# Altium schematic sheet POWER.SchDoc
size A3; Organization: Electronic Research & Design; Address1: 11 Granofier; Address2: Zwartkop; Address3: Centurion; Address4: South Africa
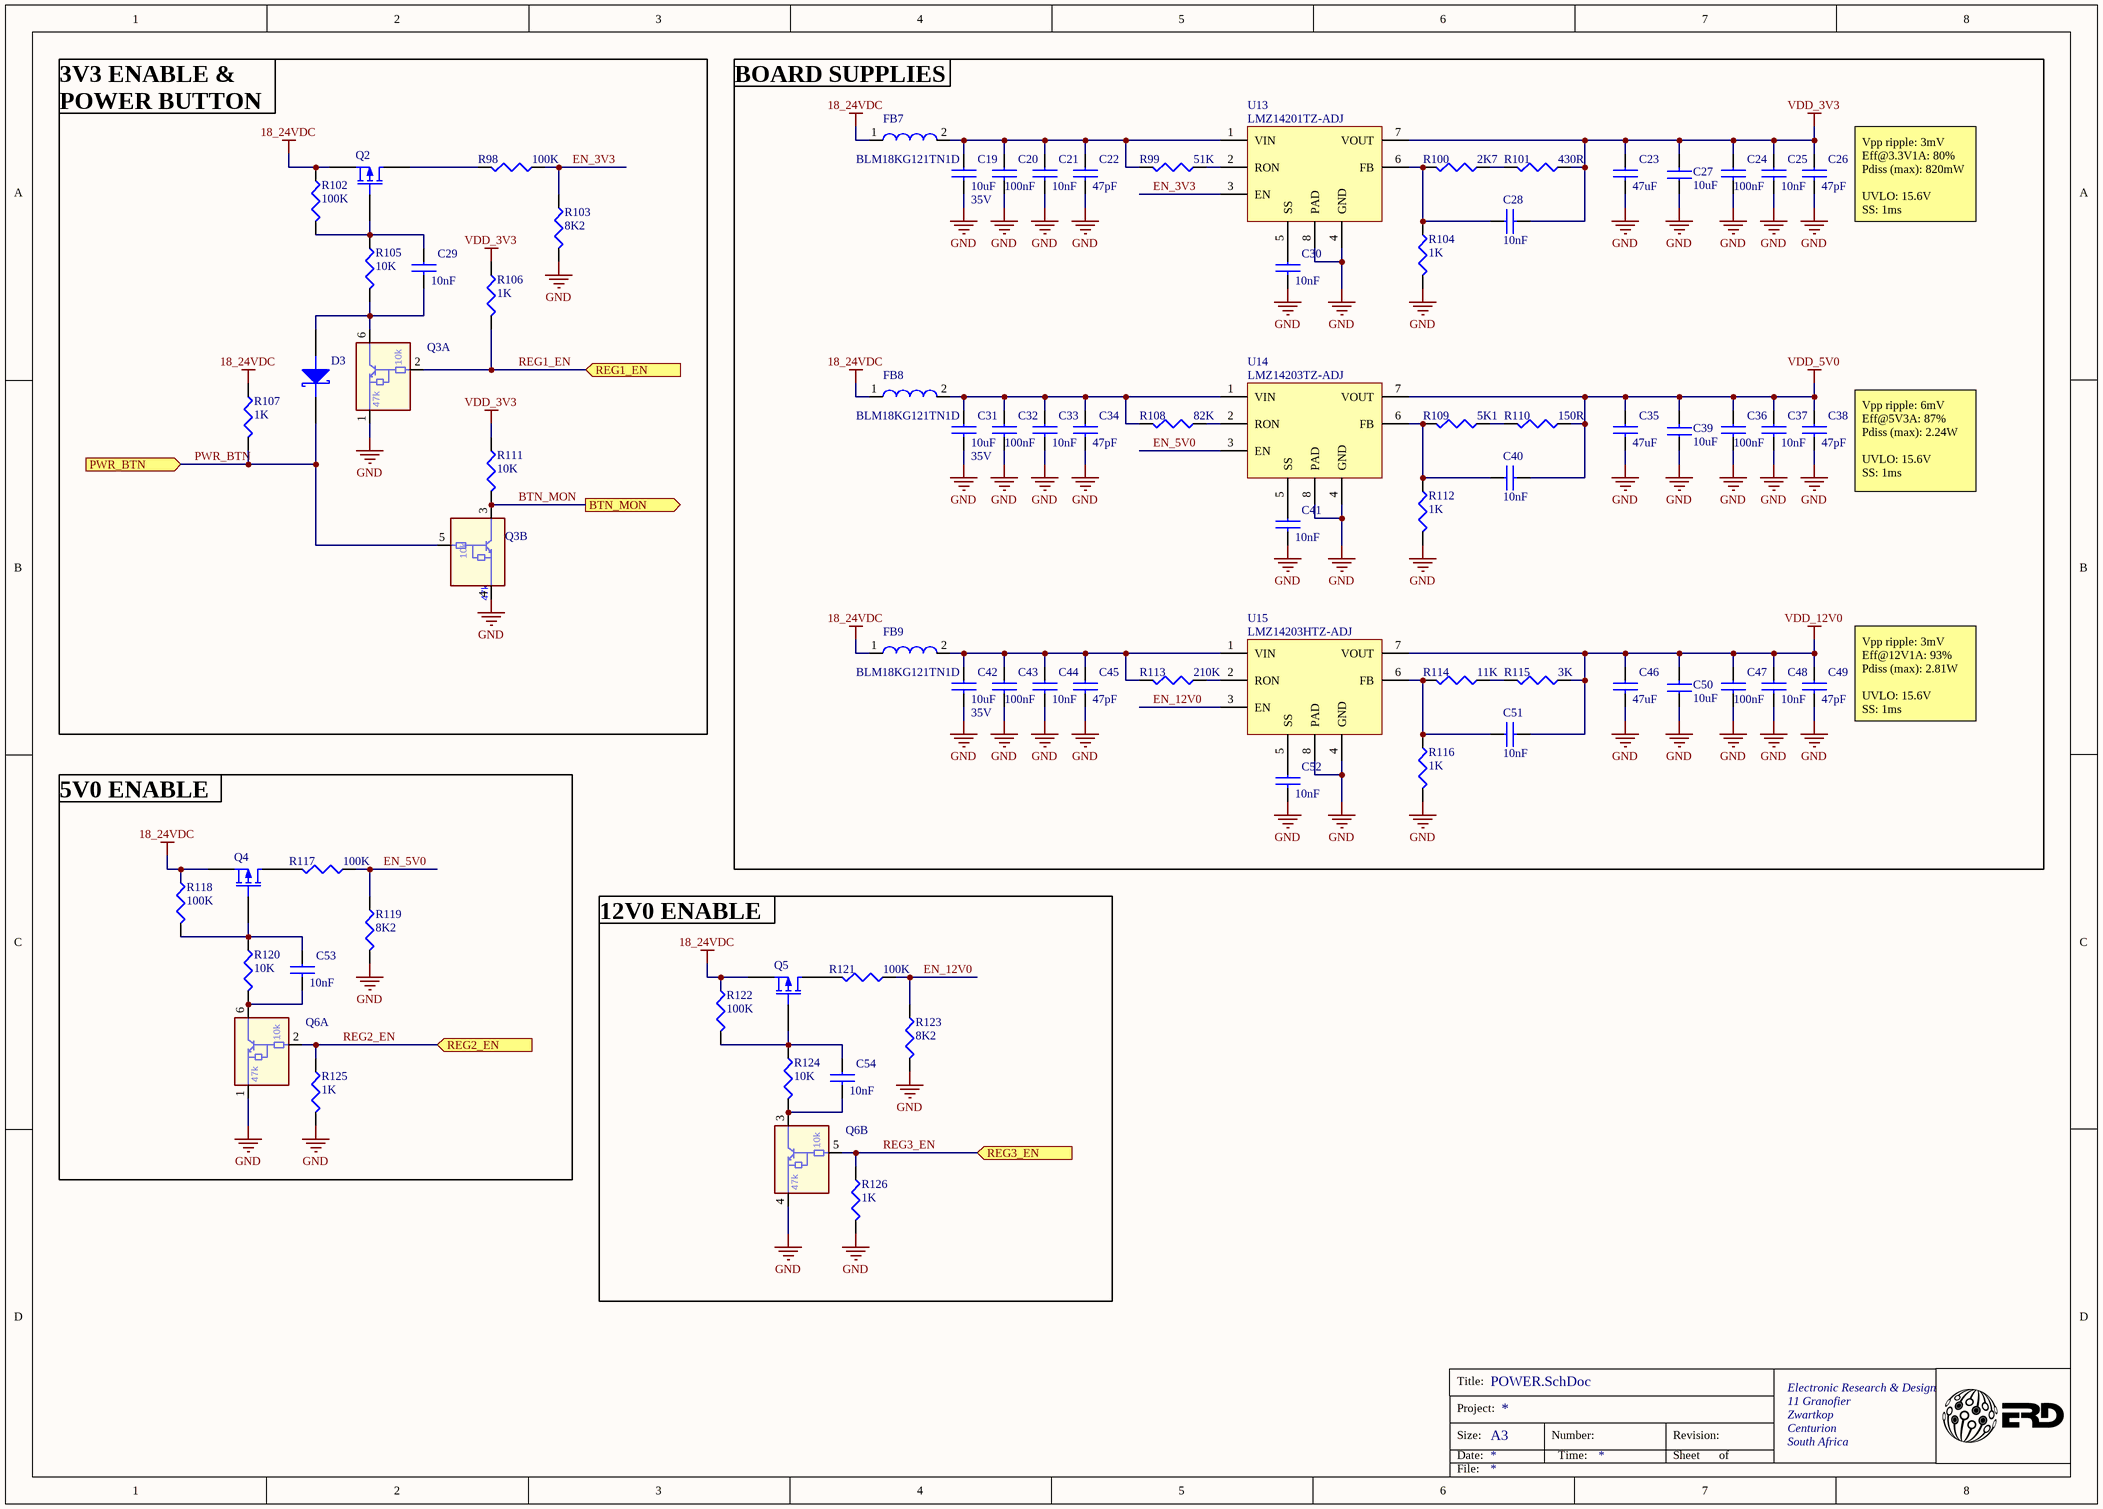
[diagram p0: POWER.SchDoc]

## Parts
C19  10uF  Voltage Rating: 35V  [CC0805]
C20  100nF  [CC0402]
C21  10nF  [CC0402]
C22  47pF  [CC0402]
C23  47uF  [RC1206]
C24  100nF  [CC0402]
C25  10nF  [CC0402]
C26  47pF  [CC0402]
C27  10uF  [CC0603]
C28  10nF  [CC0402]
C29  10nF  [CC0402]
C30  10nF  [CC0402]
C31  10uF  Voltage Rating: 35V  [CC0805]
C32  100nF  [CC0402]
C33  10nF  [CC0402]
C34  47pF  [CC0402]
C35  47uF  [RC1206]
C36  100nF  [CC0402]
C37  10nF  [CC0402]
C38  47pF  [CC0402]
C39  10uF  [CC0603]
C40  10nF  [CC0402]
C41  10nF  [CC0402]
C42  10uF  Voltage Rating: 35V  [CC0805]
C43  100nF  [CC0402]
C44  10nF  [CC0402]
C45  47pF  [CC0402]
C46  47uF  [RC1206]
C47  100nF  [CC0402]
C48  10nF  [CC0402]
C49  47pF  [CC0402]
C50  10uF  [CC0603]
C51  10nF  [CC0402]
C52  10nF  [CC0402]
C53  10nF  [CC0402]
C54  10nF  [CC0402]
D3  PMEG10020ELRX  [SOD123W]  (value not drawn)
FB7  BLM18KG121TN1D  [LC0603]
FB8  BLM18KG121TN1D  [LC0603]
FB9  BLM18KG121TN1D  [LC0603]
Q2  MOSFET-P  [E3]  (value not drawn)
Q3  DDC114YU-7-F  [SMini6-F3-B]  (value not drawn)  (parts A,B of 2)
Q4  MOSFET-P  [E3]  (value not drawn)
Q5  MOSFET-P  [E3]  (value not drawn)
Q6  DDC114YU-7-F  [SMini6-F3-B]  (value not drawn)  (parts A,B of 2)
R98  100K  [RC0402]
R99  51K  [RC0402]
R100  2K7  [RC0402]
R101  430R  [RC0402]
R102  100K  [RC0402]
R103  8K2  [RC0402]
R104  1K  [RC0402]
R105  10K  [RC0402]
R106  1K  [RC0402]
R107  1K  [RC0402]
R108  82K  [RC0402]
R109  5K1  [RC0402]
R110  150R  [RC0402]
R111  10K  [RC0402]
R112  1K  [RC0402]
R113  210K  [RC0402]
R114  11K  [RC0402]
R115  3K  [RC0402]
R116  1K  [RC0402]
R117  100K  [RC0402]
R118  100K  [RC0402]
R119  8K2  [RC0402]
R120  10K  [RC0402]
R121  100K  [RC0402]
R122  100K  [RC0402]
R123  8K2  [RC0402]
R124  10K  [RC0402]
R125  1K  [RC0402]
R126  1K  [RC0402]
U13  LMZ14201TZ-ADJ  [TZA07A]
U14  LMZ14203TZ-ADJ  [TZA07A]
U15  LMZ14203HTZ-ADJ  [TZA07A]

## Ports
BTN_MON (out), PWR_BTN (in), REG1_EN (in), REG2_EN (in), REG3_EN (in)

## Nets
18_24VDC: FB7.1 FB8.1 FB9.1 Q2.3(S) Q4.3(S) Q5.3(S) R102.1 R107.1 R118.1 R122.1
GND: C19.2 C20.2 C21.2 C22.2 C23.2 C24.2 C25.2 C26.2 C27.1 C30.2 C31.2 C32.2 C33.2 C34.2 C35.2 C36.2 C37.2 C38.2 C39.1 C41.2 C42.2 C43.2 C44.2 C45.2 C46.2 C47.2 C48.2 C49.2 C50.1 C52.2 Q3.1 Q3.4 Q6.1 Q6.4 R103.2 R104.2 R112.2 R116.2 R119.2 R123.2 R125.2 R126.2 U13.4(GND) U13.8(PAD) U14.4(GND) U14.8(PAD) U15.4(GND) U15.8(PAD)
VDD_3V3: C23.1 C24.1 C25.1 C26.1 C27.2 C28.2 R101.1 R106.1 R111.1 U13.7(VOUT)
VDD_5V0: C35.1 C36.1 C37.1 C38.1 C39.2 C40.2 R110.1 U14.7(VOUT)
VDD_12V0: C46.1 C47.1 C48.1 C49.1 C50.2 C51.2 R115.1 U15.7(VOUT)
BTN_MON: Q3.3 R111.2 ; port BTN_MON
EN_3V3: R98.1 R103.1 U13.3(EN)
EN_5V0: R117.1 R119.1 U14.3(EN)
EN_12V0: R121.1 R123.1 U15.3(EN)
PWR_BTN: D3.1 Q3.5 R107.2 ; port PWR_BTN
REG1_EN: Q3.2 R106.2 ; port REG1_EN
REG2_EN: Q6.2 R125.1 ; port REG2_EN
REG3_EN: Q6.5 R126.1 ; port REG3_EN
NetC19_1: C19.1 C20.1 C21.1 C22.1 FB7.2 R99.2 U13.1(VIN)
NetC28_1: C28.1 R100.2 R104.1 U13.6(FB)
NetC29_1: C29.1 Q2.2(G) R102.2 R105.1
NetC29_2: C29.2 D3.2 Q3.6 R105.2
NetC30_1: C30.1 U13.5(SS)
NetC31_1: C31.1 C32.1 C33.1 C34.1 FB8.2 R108.2 U14.1(VIN)
NetC40_1: C40.1 R109.2 R112.1 U14.6(FB)
NetC41_1: C41.1 U14.5(SS)
NetC42_1: C42.1 C43.1 C44.1 C45.1 FB9.2 R113.2 U15.1(VIN)
NetC51_1: C51.1 R114.2 R116.1 U15.6(FB)
NetC52_1: C52.1 U15.5(SS)
NetC53_1: C53.1 Q4.2(G) R118.2 R120.1
NetC53_2: C53.2 Q6.6 R120.2
NetC54_1: C54.1 Q5.2(G) R122.2 R124.1
NetC54_2: C54.2 Q6.3 R124.2
NetQ2_1: Q2.1(D) R98.2
NetQ4_1: Q4.1(D) R117.2
NetQ5_1: Q5.1(D) R121.2
NetR99_1: R99.1 U13.2(RON)
NetR100_1: R100.1 R101.2
NetR108_1: R108.1 U14.2(RON)
NetR109_1: R109.1 R110.2
NetR113_1: R113.1 U15.2(RON)
NetR114_1: R114.1 R115.2

## Notes on the sheet
- 3V3 ENABLE & POWER BUTTON
- BOARD SUPPLIES
- (near C26) Vpp ripple: 3mV
  Eff@3.3V1A: 80%
  Pdiss (max): 820mW
  UVLO: 15.6V
  SS: 1ms
- (near C38) Vpp ripple: 6mV
  Eff@5V3A: 87%
  Pdiss (max): 2.24W
  UVLO: 15.6V
  SS: 1ms
- (near C49) Vpp ripple: 3mV
  Eff@12V1A: 93%
  Pdiss (max): 2.81W
  UVLO: 15.6V
  SS: 1ms
- 5V0 ENABLE
- 12V0 ENABLE
- Title:
- Size:
- Date:
- Project:
- A3
- Number:
- Time:
- Revision:
- Sheet
- of
- File:
- (in symbol RN1907, part A) 10k; 47k
- (in symbol RN1907, part B) 10k; 47k

## Library data of the parts
C19 C31 C42 = CAP CER 0.1UF 10V 10% X5R 0402: CAP CER 10UF 35V 10% X5R 0805; Manufacturer: Murata; Part Number: GRM21BR6YA106KE43L; Package / Case: 0805
C20 C24 C32 C36 C43 C47 = CAP CER 0.1UF 10V 10% X5R 0402: CAP CER 0.1UF 50V 10% X7R 0402; Manufacturer: Murata; Part Number: GCM155R71H104KE02D; Package / Case: 0402 (1005 Metric); Supplier: AAD
C21 C25 C28-C30 C33 C37 C40 C41 C44 C48 C51-C54 = CAP CER 0.1UF 10V 10% X5R 0402: CAP CER 10NF 50V 10% X7R 0402; Manufacturer: Murata; Part Number: GRM155R71H103KA88J; Package / Case: 0402; Voltage Rating: 50V
C22 C26 C34 C38 C45 C49 = CAP CER 0.1UF 10V 10% X5R 0402: CAP CER 47PF 50V 5% C0G/NP0 0402; Manufacturer: Murata; Part Number: GCM1555C1H470JA16D; Package / Case: 0402; Voltage Rating: 50V
C23 C35 C46 = CAP CER 0.1UF 10V 10% X5R 0402: CAP CER 47UF 25V 20% X5R 1206; Manufacturer: Murata; Part Number: C3216X5R1E476M160AC; Package / Case: 1206; Voltage Rating: 25v
C27 C39 C50 = CAP CER 0.1UF 10V 10% X5R 0402: CAP CER 10UF 25V 20% X5R 0603; Manufacturer: Murata; PartNumber: GRM188R61E106MA73D; Package / Case: 0603; Supplier: AAD
D3 = DIODE SCHOTTKY: DIODE, SCHOTTKY, 100V, 2A, 3.7ns, SOD123W; PartNumber: PMEG10020ELRX
FB7-FB9 = FER_180_200_0: FERRITE 3A 30mOHM 0603 SMD; PartNumber: BLM18KG121TN1D
Q2 Q4 Q5 = MOSFET-P: P-Channel MOSFET; Published: 8-Jun-2000; LatestRevisionDate: 17-Jul-2002; LatestRevisionNote: Re-released for DXP Platform.; PackageVersion: 1995/1996; PackageReference: E3; Publisher: Altium Limited; PackageDescription: TO, Flat Index; 3 In-Line, Axial Leads; Body Dia. 4.6mm; Lead Dia. 0.5 mm (max)
Q3 Q6 = RN1907: TRANS PREBIASED DUAL NPN SOT363; Manufacturer: Diodes Inc; Manufacturer Part Number: DDC114YU-7-F; Package / Case: 6-TSSOP, SC-88, SOT-363; Supplier: AAD; Supplier Stock Code: N/A
R98 R117 R121 = RES_10K_1/16W_1%_0402: RES, 100K OHM, 1/16W, 1%, 0402; Manufacturer: Yageo; PartNumber: RC0402FR-07100KL; Package / Case: 0402 (1005 Metric); Supplier: AAD
R99 = RES_10K_1/16W_1%_0402: RES, 51K OHM, 1/16W, 1%, 0402; Manufacturer: Yageo; PartNumber: RC0402FR-0751KL; Package / Case: 0402 (1005 Metric); Supplier: AAD
R100 = RES_10K_1/16W_1%_0402: RES, 2K7 OHM, 1/16W, 1%, 0402; Manufacturer: Yageo; PartNumber: RC0402FR-072K7L; Package / Case: 0402 (1005 Metric); Supplier: AAD
R101 = RES_10K_1/16W_1%_0402: RES, 430 OHM, 1/16W, 1%, 0402; Manufacturer: Yageo; PartNumber: RC0402FR-07430RL; Package / Case: 0402 (1005 Metric); Supplier: AAD
R102 R118 R122 = RES_10K_1/16W_1%_0402: RES, 100K OHM, 1/16W, 1%, 0402; Manufacturer: Yageo; Part Number: RC0402FR-07100KL; Package / Case: 0402 (1005 Metric); Supplier: AAD
R103 R119 R123 = RES_10K_1/16W_1%_0402: RES, 8K2 OHM, 1/16W, 1%, 0402; Manufacturer: Yageo; PartNumber: RC0402FR-078K2L; Package / Case: 0402 (1005 Metric); Supplier: AAD
R104 R106 R107 R112 R116 R125 R126 = RES_10K_1/16W_1%_0402: RES, 1K OHM, 1/16W, 1%, 0402; Manufacturer: Yageo; PartNumber: RC0402FR-071KL; Package / Case: 0402 (1005 Metric); Supplier: AAD
R105 R111 R120 R124 = RES_10K_1/16W_1%_0402: RES, 10K OHM, 1/16W, 1%, 0402; Manufacturer: Yageo; Part Number: RC0402FR-0710KL; Package / Case: 0402 (1005 Metric); Supplier: AAD
R108 = RES_10K_1/16W_1%_0402: RES, 82K OHM, 1/16W, 1%, 0402; Manufacturer: Yageo; PartNumber: RC0402FR-0782KL; Package / Case: 0402 (1005 Metric); Supplier: AAD
R109 = RES_10K_1/16W_1%_0402: RES, 5K1 OHM, 1/16W, 1%, 0402; Manufacturer: Yageo; PartNumber: RC0402FR-075K1L; Package / Case: 0402 (1005 Metric); Supplier: AAD
R110 = RES_10K_1/16W_1%_0402: RES, 150 OHM, 1/16W, 1%, 0402; Manufacturer: Yageo; PartNumber: RC0402FR-07150RL; Package / Case: 0402 (1005 Metric); Supplier: AAD
R113 = RES_10K_1/16W_1%_0402: RES, 210K OHM, 1/16W, 1%, 0402; Manufacturer: Yageo; PartNumber: RC0402FR-07210KL; Package / Case: 0402 (1005 Metric); Supplier: AAD
R114 = RES_10K_1/16W_1%_0402: RES, 11K OHM, 1/16W, 1%, 0402; Manufacturer: Yageo; PartNumber: RC0402FR-0711KL; Package / Case: 0402 (1005 Metric); Supplier: AAD
R115 = RES_10K_1/16W_1%_0402: RES, 3K OHM, 1/16W, 1%, 0402; Manufacturer: Yageo; PartNumber: RC0402FR-073KL; Package / Case: 0402 (1005 Metric); Supplier: AAD
U13-U15 = LMZ14201: Buc Converter, SimpleSwitcher, 42V, 1A, TO-PMOD-7; Manufacturer: Texas Instruments
  U13: PartNumber: LMZ14201TZ-ADJ
  U14: PartNumber: LMZ14203TZ-ADJ
  U15: PartNumber: LMZ14203HTZ-ADJ